# EAGLE design untitled (EAGLE 9.6.2)
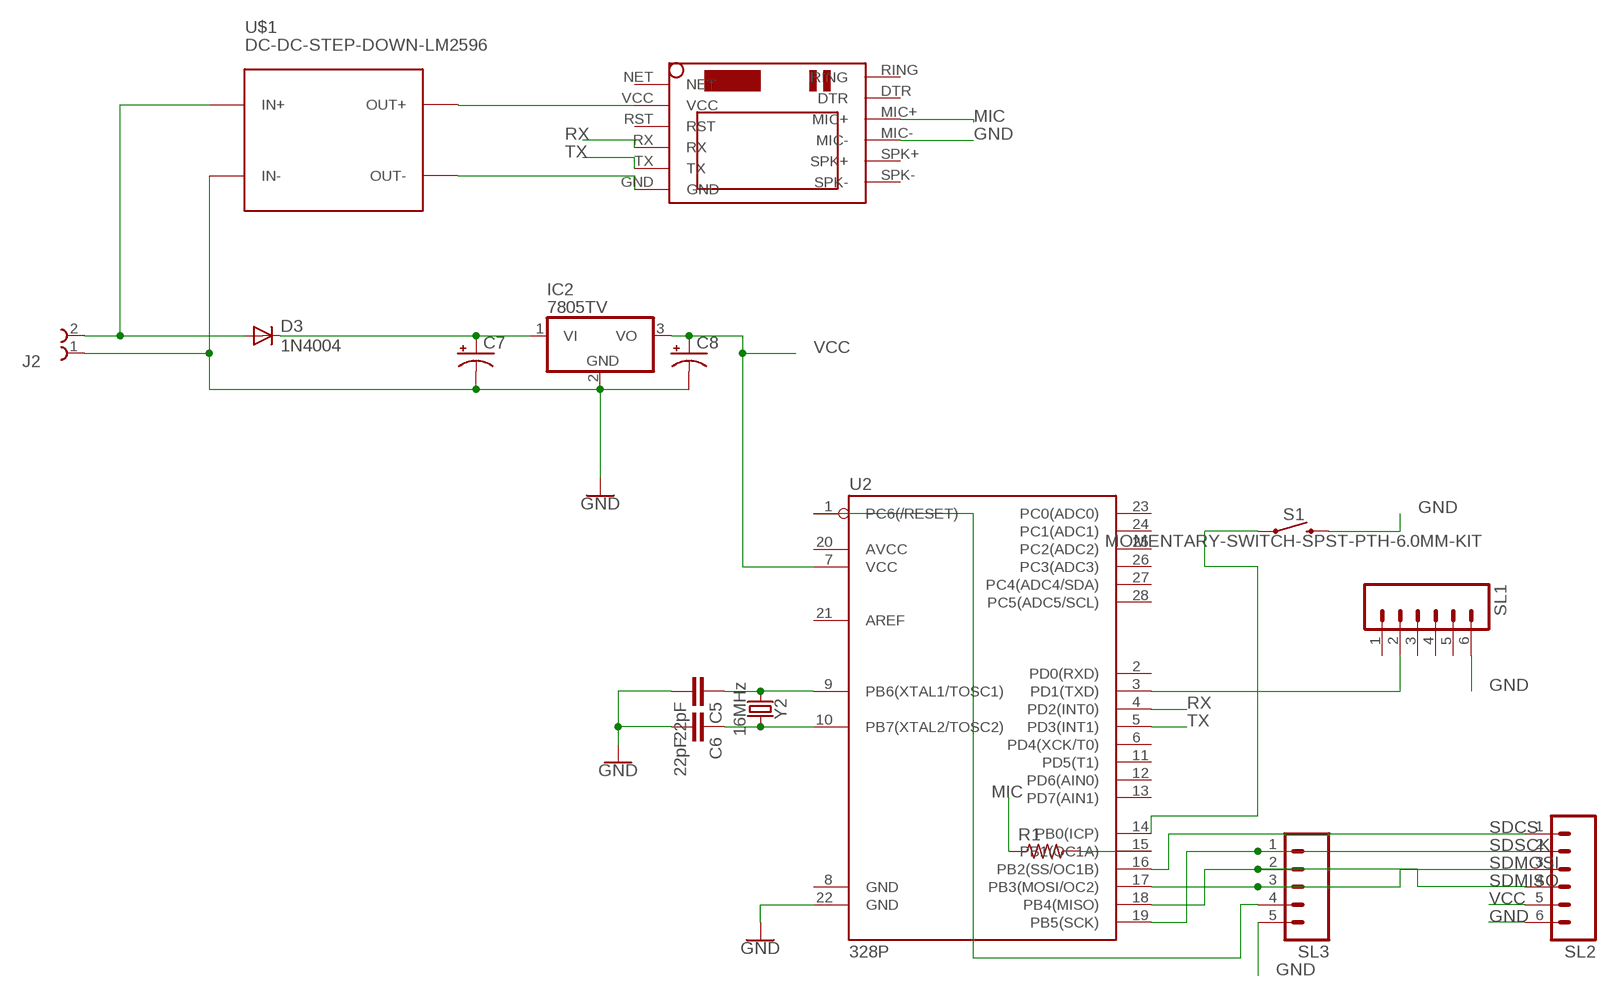
[diagram p0: schematic, sheet 1]

## Parts
C5  22pF  22PF-PTH-2.54MM-200V-5%  [CAP-PTH-2.54]
C6  22pF  22PF-PTH-2.54MM-200V-5%  [CAP-PTH-2.54]
C7  CAPACITOR-PE5-8.5  [E5-8,5]
C8  CAPACITOR-PE5-5  [E5-5]
D3  1N4004  [DO41-10]
IC2  7805TV  [TO220V]
J2  691201520002  [691201520002]
R1  R-US_0207/10  [0207/10]
S1  MOMENTARY-SWITCH-SPST-PTH-6.0MM-KIT  [TACTILE_SWITCH_PTH_6.0MM_KIT]
SL1  M06  [06P]
SL2  M06  [06P]
SL3  M05  [05P]
U2  328P  ATMEGA328P_PDIP  [DIP28]
U$1  DC-DC-STEP-DOWN-LM2596  [DC-DC-STEP-DOWN-LM2596]
U$2  SIM800LMODULE  [SIM800LMODULE]
Y2  16MHz  CRYSTAL-16MHZPTH-HC49US  [HC49US]

## Nets
GND: C5.2 C6.2 C7.- C8.- IC2.2(GND) J2.1 S1.3 SL1.6 SL2.6 SL3.5 U2.22(GND) U$1.IN- U$2.MIC-
MIC: R1.1 U$2.MIC+
N$1: U$1.OUT+ U$2.VCC
N$2: U$1.OUT- U$2.GND
N$3: R1.2 U2.15(PB1(OC1A))
N$4: S1.1 U2.14(PB0(ICP))
N$6: SL3.4 U2.1(PC6(/RESET))
N$10: C5.1 U2.9(PB6(XTAL1/TOSC1)) Y2.1
N$11: C6.1 U2.10(PB7(XTAL2/TOSC2)) Y2.2
N$12: D3.A J2.2 U$1.IN+
N$13: C7.+ D3.C IC2.1(VI)
RX: U2.4(PD2(INT0)) U$2.RX
SDCS: SL2.1 U2.16(PB2(SS/OC1B))
SDMISO: SL2.4 SL3.2 U2.18(PB4(MISO))
SDMOSI: SL2.3 SL3.3 U2.17(PB3(MOSI/OC2))
SDSCK: SL2.2 SL3.1 U2.19(PB5(SCK))
TX: U2.5(PD3(INT1)) U$2.TX
TX1: SL1.2 U2.3(PD1(TXD))
VCC: C8.+ IC2.3(VO) SL2.5 U2.7(VCC)
Unconnected: SL1.1 SL1.3 SL1.4 SL1.5 U2.2(PD0(RXD)) U2.6(PD4(XCK/T0)) U2.8(GND) U2.11(PD5(T1)) U2.12(PD6(AIN0)) U2.13(PD7(AIN1)) U2.20(AVCC) U2.21(AREF) U2.23(PC0(ADC0)) U2.24(PC1(ADC1)) U2.25(PC2(ADC2)) U2.26(PC3(ADC3)) U2.27(PC4(ADC4/SDA)) U2.28(PC5(ADC5/SCL)) U$2.DTR U$2.NET U$2.RING U$2.RST U$2.SPK+ U$2.SPK-

## Library data of the parts
C5 C6 = SparkFun-Capacitors:22PF: 22pF ceramic capacitors A capacitor is a passive two-terminal electrical component used to store electrical energy temporarily in an electric field.; PROD_ID: CAP-09128
C7 C8 = BeagleBone_Blue_R3:CAPACITOR-P: POLARIZED CAPACITOR, American symbol
D3 = adafruit:1N4004: DIODE General purpose 1N400x type rectifier (With bigger pads) http://www.ladyada.net/library/pcb/eaglelibrary.html
IC2 = linear:78*: Positive VOLTAGE REGULATOR Source: http://cache.national.com/ds/LM/LM78L05.pdf http://www.fairchildsemi.com/ds/LM/LM7805.pdf
J2 = Wurth_Elektronik_Electromechanic_Terminal_Blocks_Connectors_rev19b:691201520002: WR-TBL2 SERIE 2015 - 5.08 MM - 45° CABLE ENTRY WITH RISING CAGE CLAMP - 2 pins <http://katalog.we-online.de/media/thumbs2/eican/thb_Con_TBL_Screw_RisingClamp_5.08_6912015200xx_pf2.jpg> Details see: http://katalog.we-online.de/en/em/TBL_5_08_2015_45%C2%B0_ENTRY_W_RISING_CAGE_69120152000x Created on 2015-07-09 2015 (C) Wurth Elektronik
R1 = BeagleBone_Black_Wireless:R-US_: RESISTOR, American symbol
S1 = SparkFun-Switches:MOMENTARY-SWITCH-SPST: Momentary Switch (Pushbutton) - SPST Normally-open (NO) SPST momentary switches (buttons, pushbuttons). Variants PTH-12MM - 12mm square, through-hole Momentary Pushbutton Switch - 12mm Square <https://www.sparkfun.com/products/9190> (COM-09190) PTH-6.0MM, PTH-6.0MM-KIT - 6.0mm square, through-hole Mini Pushbutton Switch <https://www.sparkfun.com/products/97> (COM-00097) KIT package intended for soldering kit's - only one side of pads' copper is exposed. PTH-RIGHT-ANGLE-KIT - Right-angle, through-hole Right Angle Tactile Button <https://www.sparkfun.com/products/10791> - Used on SparkFun BigTime Watch Kit <https://www.sparkfun.com/products/11734> SMD-12MM - 12mm square, surface-mount Tactile Button - SMD (12mm) <https://www.sparkfun.com/products/12993> (COM-12993) Used on SparkFun PicoBoard <https://www.sparkfun.com/products/11888> SMD-4.5MM - 4.5mm Square Trackball Switch Used on SparkFun Blackberry Trackballer Breakout <https://www.sparkfun.com/products/13169> SMD-4.6MMX2.8MM - 4.60mm x 2.80mm, surface mount Used on SparkFun SAMD21 Mini Breakout <https://www.sparkfun.com/products/13664> SMD-5.2MM, SMD-5.2-REDUNDANT - 5.2mm square, surface-mount Mini Pushbutton Switch - SMD <https://www.sparkfun.com/products/8720> (COM-08720) Used on Arduino Pro Mini <https://www.sparkfun.com/products/11114> REDUNDANT package connects both switch circuits together SMD-6.0X3.5MM - 6.0 x 3.5mm, surface mount Momentary Reset Switch SMD <https://www.sparkfun.com/products/8229> (COM-08229) SMD-6.2MM-TALL - 6.2mm square, surface mount Tactile Button - SMD (6mm) <https://www.sparkfun.com/products/12992> Used on SparkFun Digital Sandbox <https://www.sparkfun.com/products/12651> SMD-RIGHT-ANGLE - Right-angle, surface mount Used on SparkFun Block for Intel® Edison - Arduino <https://www.sparkfun.com/products/13036>; PROD_ID: SWCH-08441; SF_SKU: COM-00097
SL1 SL2 = con-amp-quick:M06: AMP QUICK CONNECTOR; OC_FARNELL: unknown; OC_NEWARK: unknown
SL3 = con-amp-quick:M05: AMP QUICK CONNECTOR; OC_FARNELL: unknown; OC_NEWARK: unknown
U2 = SparkFun-IC-Microcontroller:ATMEGA328P_PDIP: Atmel 328P Through hole ATMEGA328P uC used in the Arduino 32kb flash, 1k EEPROM, 2k SRAM Datasheet <http://www.sparkfun.com/datasheets/Components/SMD/ATMega328.pdf> SparkFun Products Storefront component: AVR 28 Pin 20MHz 32K 6A/D - ATMega328P <https://www.sparkfun.com/products/9061> (COM-09061) SparkFun Simon Says - Through-Hole Soldering Kit <https://www.sparkfun.com/products/10547> (KIT-10547) SparkFun Learn to Solder - Simon Says <https://www.sparkfun.com/products/13708> (KIT-13708) SparkFun BigTime Watch Kit <https://www.sparkfun.com/products/11734> (KIT-11734) SparkFun ClockIt <https://www.sparkfun.com/products/10930> (KIT-10930) SparkFun Serial Enabled LCD Kit <https://www.sparkfun.com/products/10097> (LCD-10097) SparkFun Simon Tilts - Through Hole Soldering Kit <https://www.sparkfun.com/products/12634> (KIT-12634) SparkFun Frequency Counter Kit <https://www.sparkfun.com/products/10140> (KIT-10140) FabFM Radio Kit <https://www.sparkfun.com/products/11043> (KIT-11043) SparkFun Binary Blaster Kit <https://www.sparkfun.com/products/12037> (KIT-12037) SparkFun Metro-Gnome <https://www.sparkfun.com/products/9236> (KIT-09236) ATmega328 with Arduino Optiboot (Uno) <https://www.sparkfun.com/products/10524> (DEV-10524); PROD_ID: IC-09136
U$1 = diy-modules:DC-DC-STEP-DOWN-LM2596: DC/DC Step-Down Regulator based on LM2596-ADJ chip LM2596 datasheet available here: http://www.ti.com/lit/ds/symlink/lm2596.pdf Click here to find device on ebay.com <http://www.ebay.com/sch/lm2596+power+regulator>
U$2 = SIM800LMODULE:SIM800LMODULE: SIM800L Module
Y2 = SparkFun-Clocks:CRYSTAL-16MHZ: 16MHz Crystal Digikey Example <http://www.digikey.com/product-search/en?keywords=535-9122-1-ND> Frequency: 16MHz Frequency Stability: ±50ppm Frequency Tolerance: ±20ppm Load Capacitance: 18pF SparkFun Products: Pro Micro -5V/16MHz <https://www.sparkfun.com/products/12640> SparkFun Serial Enabled LCD Kit <https://www.sparkfun.com/products/10097>; PROD_ID: XTAL-08181; SF_ID: COM-00536

## Board
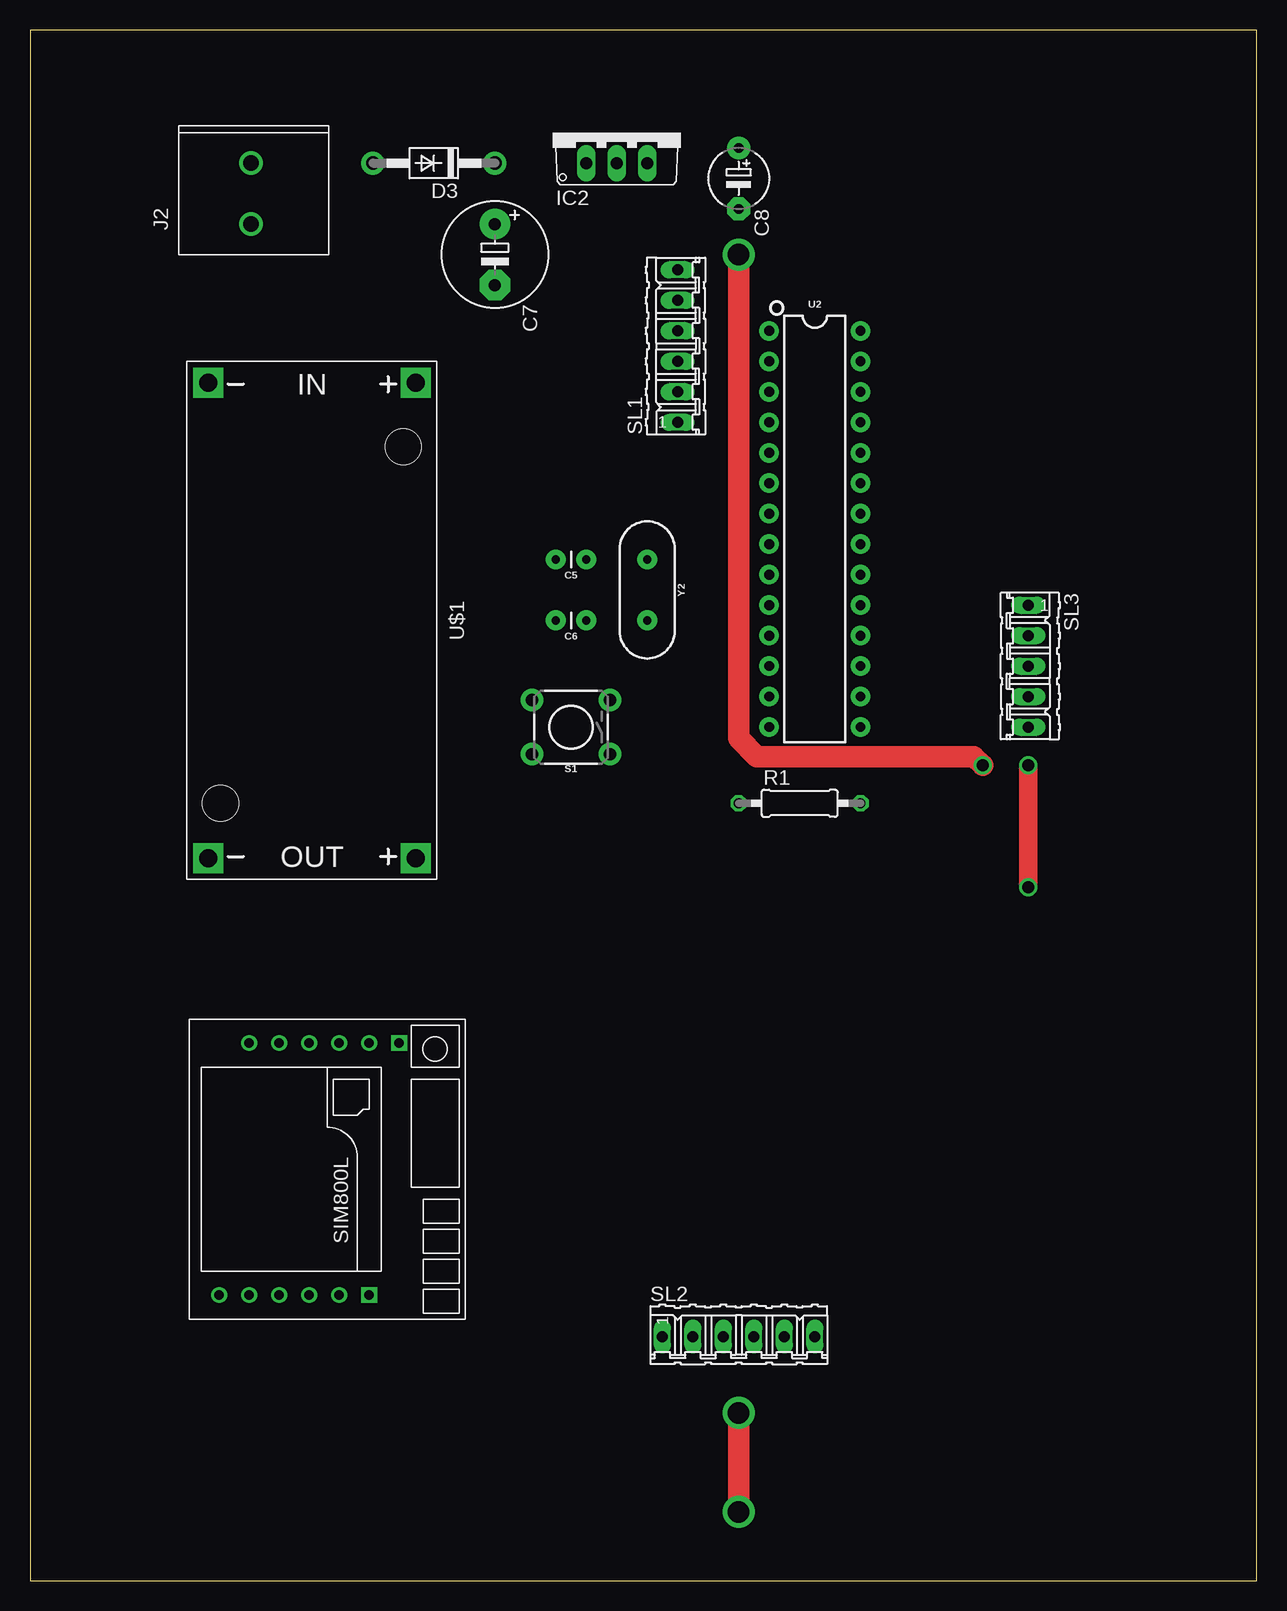
[diagram p1: board, top side]
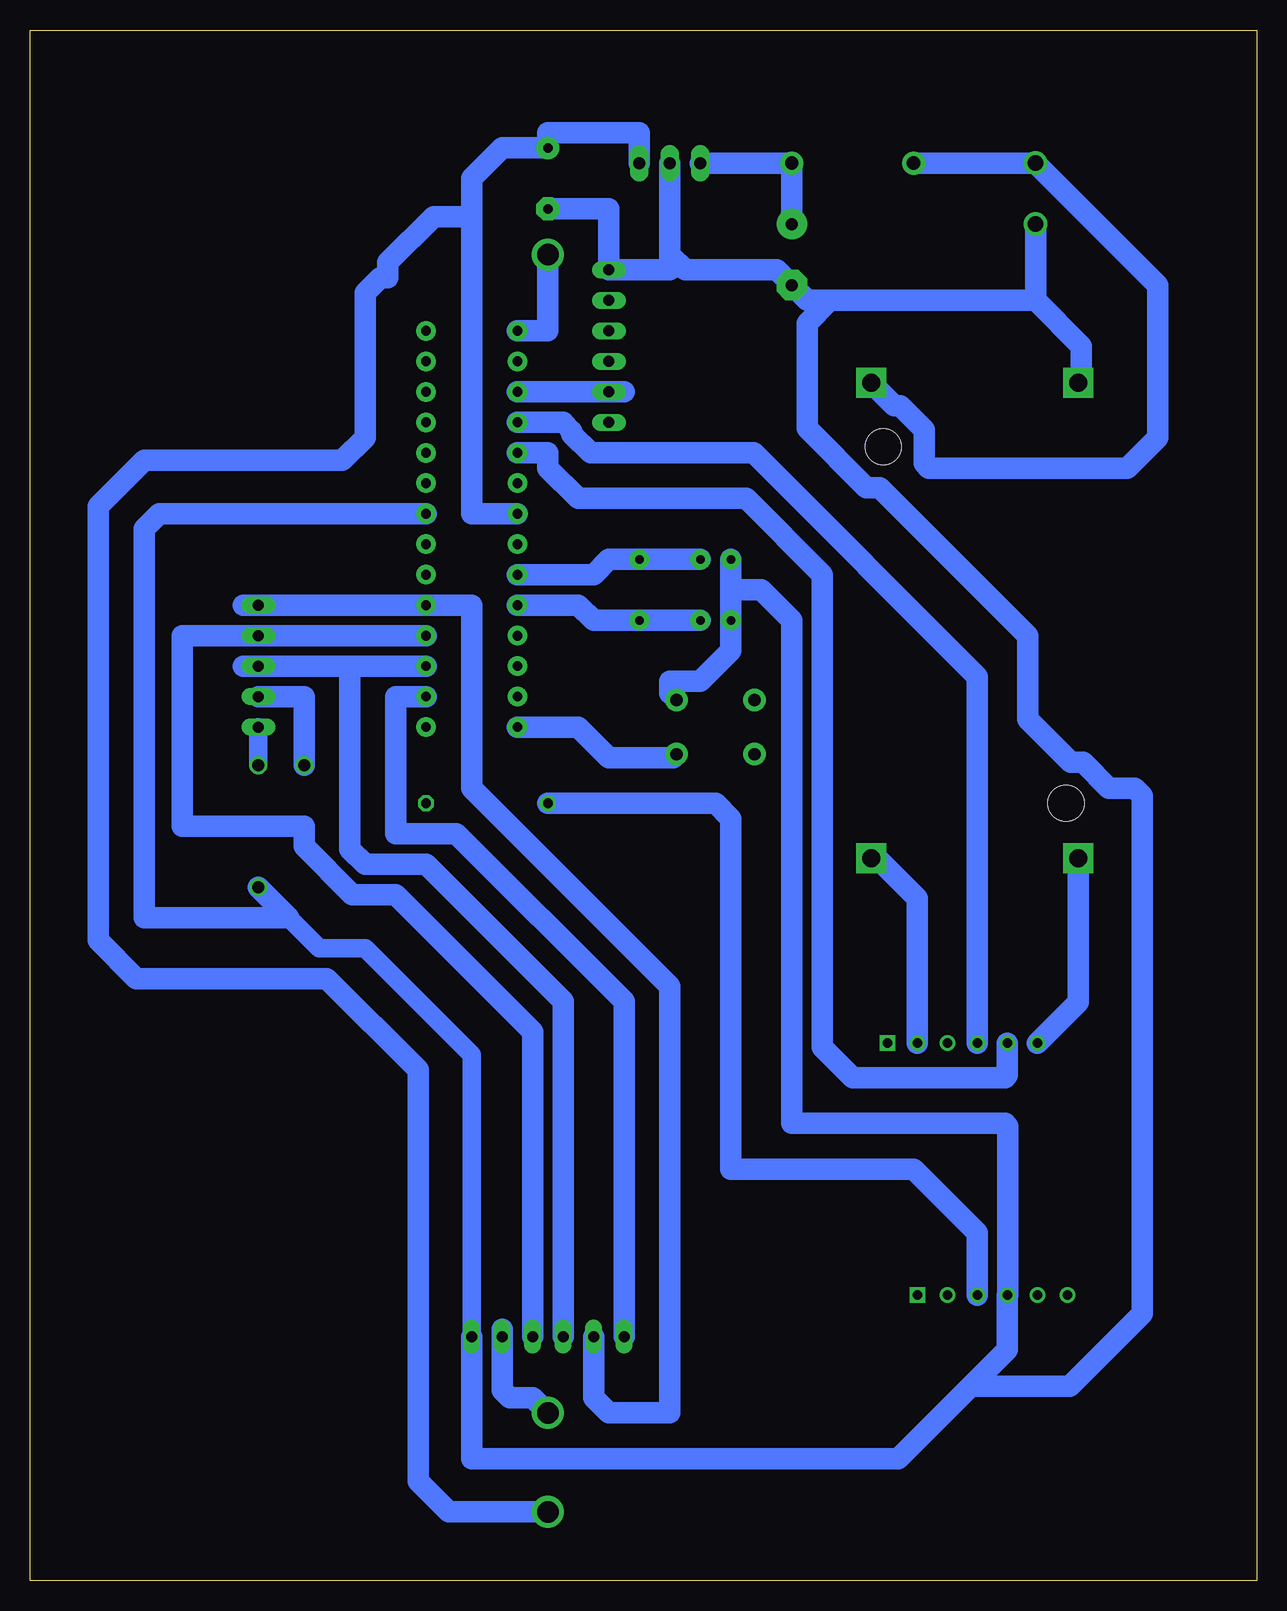
[diagram p2: board, bottom side, seen from below]

Size 102.22 x 129.21 mm. Coordinates in mm from the lower left corner, seen from the top.
Outline: 0,0 102.22,0 102.22,129.21 0,129.21 0,0
Copper layers (1*16): Top 0.035mm / dielectric 1.5mm / Bottom 0.035mm
Design rules "default *": minimum track width 70mil, minimum drill 0.35mm, track to track 30mil, track to pad 30mil, pad to pad 30mil, via to via 30mil, smd to smd 6mil, copper to edge 40mil, drill to drill 6mil, minimum pad ring 10mil, minimum via ring 8mil, stop-mask expansion 4mil, vias tented up to drill 0mil, thermal gap 10mil

### Footprints (pad centres in the part's own frame; a part is rotated, then mirrored left to right if it is on the bottom)
CAP-PTH-2.54 = drill 0.7 pad 1.651: 1 -1.27,0; 2 1.27,0
E5-8,5 = drill 1.016 pad 2.54: + -2.54,0 | drill 1.016 pad 2.54 octagon: - 2.54,0
E5-5 = drill 0.813 pad 1.905: + -2.54,0 | drill 0.813 pad 1.905 octagon: - 2.54,0
DO41-10 = drill 1.118 pad 1.93: A 5.08,0; C -5.08,0
TO220V = drill 1.016 long: 1 -2.54,-2.54; 2 0,-2.54; 3 2.54,-2.54
691201520002 = drill 1.3: 1 -2.54,0; 2 2.54,0
0207/10 = drill 0.813 octagon: 1 -5.08,0; 2 5.08,0
TACTILE_SWITCH_PTH_6.0MM_KIT = drill 1.016 pad 1.88: 1 -3.251,2.261; 2 3.251,2.261; 3 -3.251,-2.261; 4 3.251,-2.261
06P = drill 0.914 long: 1 -6.35,0; 2 -3.81,0; 3 -1.27,0; 4 1.27,0; 5 3.81,0; 6 6.35,0
05P = drill 0.914 long: 1 -5.08,0; 2 -2.54,0; 3 0,0; 4 2.54,0; 5 5.08,0
DIP28 = drill 0.813 pad 1.626: 1 -16.51,-3.81; 2 -13.97,-3.81; 3 -11.43,-3.81; 4 -8.89,-3.81; 5 -6.35,-3.81; 6 -3.81,-3.81; 7 -1.27,-3.81; 8 1.27,-3.81; 9 3.81,-3.81; 10 6.35,-3.81; 11 8.89,-3.81; 12 11.43,-3.81; 13 13.97,-3.81; 14 16.51,-3.81; 15 16.51,3.81; 16 13.97,3.81; 17 11.43,3.81; 18 8.89,3.81; 19 6.35,3.81; 20 3.81,3.81; 21 1.27,3.81; 22 -1.27,3.81; 23 -3.81,3.81; 24 -6.35,3.81; 25 -8.89,3.81; 26 -11.43,3.81; 27 -13.97,3.81; 28 -16.51,3.81
DC-DC-STEP-DOWN-LM2596 = drill 1.5 pad 2.5 square: IN+ -19.812,8.636; IN- -19.812,-8.636; OUT+ 19.812,8.636; OUT- 19.812,-8.636 | hole 3: -14.478,7.62; 15.24,-7.62
SIM800LMODULE = drill 0.8: DTR 10.5,1; GND -10.5,-6.5; MIC+ 10.5,-1.5; MIC- 10.5,-4; RST -10.5,1; RX -10.5,-1.5; SPK+ 10.5,-6.5; SPK- 10.5,-9; TX -10.5,-4; VCC -10.5,3.5 | drill 0.8 square: NET -10.5,6; RING 10.5,3.5
HC49US = drill 0.7 pad 1.651: 1 -2.54,0; 2 2.54,0

### Placement (x,y rotation side)
C5  45.09,85.09 180 top
C6  45.09,80.01 180 top
C7  38.74,110.49 270 top
C8  59.05,116.84 270 top
D3  33.66,118.11 180 top
IC2  48.9,120.65 0 top
J2  18.41,115.57 90 top
R1  64.13,64.77 0 top
S1  45.09,71.12 180 top
SL1  53.98,102.87 90 top
SL2  59.05,20.32 0 top
SL3  83.19,76.2 270 top
U2  65.41,87.63 270 top
U$1  23.49,80.01 270 top
U$2  24.77,34.29 270 top
Y2  51.43,82.55 270 top

### Tracks (layer width: path | path; a pad name or v marks a point on that pad's centre or on a via)
GND  (via drill 1 pad 1.2)
  Top 1.524: v83.19,67.94 v83.19,57.78
  Bottom 1.524: 80.65,55.25 78.1,52.7 74.29,52.7 65.41,43.81 65.41,19.05 | SL3.5 v83.19,67.94
  Bottom 1.778: 18.41,106.68 14.6,102.87 14.6,100.08 U$1.IN- | J2.1 18.41,106.68 | 35.56,106.68 37.46,106.68 C7.- 40.01,109.22 47.63,109.22 48.9,110.49 | 35.56,106.68 18.41,106.68 | 48.9,110.49 IC2.2 | 48.9,110.49 48.9,109.22 SL1.6 53.98,114.3 C8.- | 43.82,82.55 C6.2 43.82,77.47 46.35,74.93 48.9,74.93 48.9,73.94 S1.3 | 43.82,82.55 C5.2 | U$2.MIC- 20.77,19.24 23.81,16.19 | SL2.6 65.41,19.05 65.41,10.16 29.84,10.16 23.81,16.19 | 43.82,82.55 41.27,82.55 38.74,80.01 38.74,38.1 20.95,38.1 20.73,37.87 20.73,23.79 | v83.19,57.78 80.65,55.25 92.71,55.25 92.71,87.63 91.44,88.9 U2.22 | 35.56,106.68 37.46,104.78 37.46,96.02 32.52,91.08 31.39,91.08 19.05,78.74 19.05,71.75 15.47,68.17 14.47,68.17 12.33,66.04 10.16,66.04 9.52,65.41 9.52,22.23 15.56,16.19 23.81,16.19
MIC
  Bottom 1.778: U$2.MIC+ 23.27,28.98 28.58,34.29 43.82,34.29 43.82,63.5 45.09,64.77 R1.1
N$1
  Bottom 1.778: U$2.VCC 28.27,56.84 31.62,60.2 U$1.OUT+
N$2
  Bottom 1.778: U$1.OUT- 14.86,48.2 U$2.GND
N$4
  Bottom 1.778: S1.1 48.62,68.58 53.98,68.58 56.51,71.12 U2.14
N$6  (via drill 1 pad 1.3, 1.78 pad 1.3)
  Top 1.778: v79.38,67.94 78.66,68.66 60.57,68.66 59.05,70.18 v59.05,110.49
  Bottom 1.778: SL3.4 79.38,73.66 v79.38,67.94 | v59.05,110.49 59.05,104.14 U2.1
N$10
  Bottom 1.778: U2.9 55.24,83.82 53.98,85.09 Y2.1 C5.1
N$11
  Bottom 1.778: U2.10 56.51,81.28 55.24,80.01 Y2.2 C6.1
N$12
  Bottom 1.778: D3.A J2.2 8.26,107.95 8.26,95.25 10.8,92.71 27.3,92.71 27.71,93.12 27.71,95.9 29.7,97.89 30.2,97.89 U$1.IN+
N$13
  Bottom 1.778: C7.+ D3.C IC2.1
RX
  Bottom 1.778: U2.4 57.79,96.52 57.05,95.78 57.05,95.54 55.49,93.98 41.91,93.98 23.27,75.34 U$2.RX
SDCS
  Bottom 1.778: SL2.1 52.71,48.26 66.68,62.23 71.75,62.23 71.75,73.66 U2.16
SDMISO
  Bottom 1.778: U2.18 SL3.2 | 84.46,78.74 SL3.2 | SL2.4 60.32,45.72 71.75,57.15 75.35,57.15 79.38,61.18 79.38,62.87 89.53,62.87 89.53,78.74 SL3.2
SDMOSI
  Bottom 1.778: U2.17 75.56,76.2 | 75.56,76.2 SL3.3 84.46,76.2 | SL2.3 57.79,48.26 69.22,59.69 74.29,59.69 75.56,60.96 75.56,76.2
SDSCK
  Bottom 1.778: 84.46,81.28 SL3.1 U2.19 65.41,81.28 65.41,66.04 48.9,49.53 48.9,13.97 53.98,13.97 55.24,15.24 SL2.2
TX
  Bottom 1.778: U$2.TX 20.77,42.1 20.95,41.91 33.66,41.91 36.2,44.45 36.2,83.82 42.54,90.17 56.51,90.17 59.05,92.71 59.05,93.96 59.08,93.98 U2.5
TX1
  Bottom 1.778: U2.3 SL1.2 52.71,99.06
VCC  (via drill 1.78 pad 1.3)
  Top 1.778: v59.05,5.72 v59.05,13.97
  Bottom 1.778: IC2.3 51.43,120.65 59.05,120.65 C8.+ 62.87,119.38 65.41,116.84 65.41,113.66 | 65.41,113.66 65.41,88.9 U2.7 | 65.41,113.66 68.58,113.66 72.39,109.85 72.39,108.59 73.03,108.59 74.29,107.31 74.29,95.25 76.2,93.34 92.71,93.34 96.52,89.53 96.52,53.34 93.34,50.16 77.47,50.16 69.85,42.55 69.85,8.26 67.31,5.72 v59.05,5.72 | v59.05,13.97 60.32,15.24 62.23,15.24 62.87,15.88 SL2.5 62.87,20.96